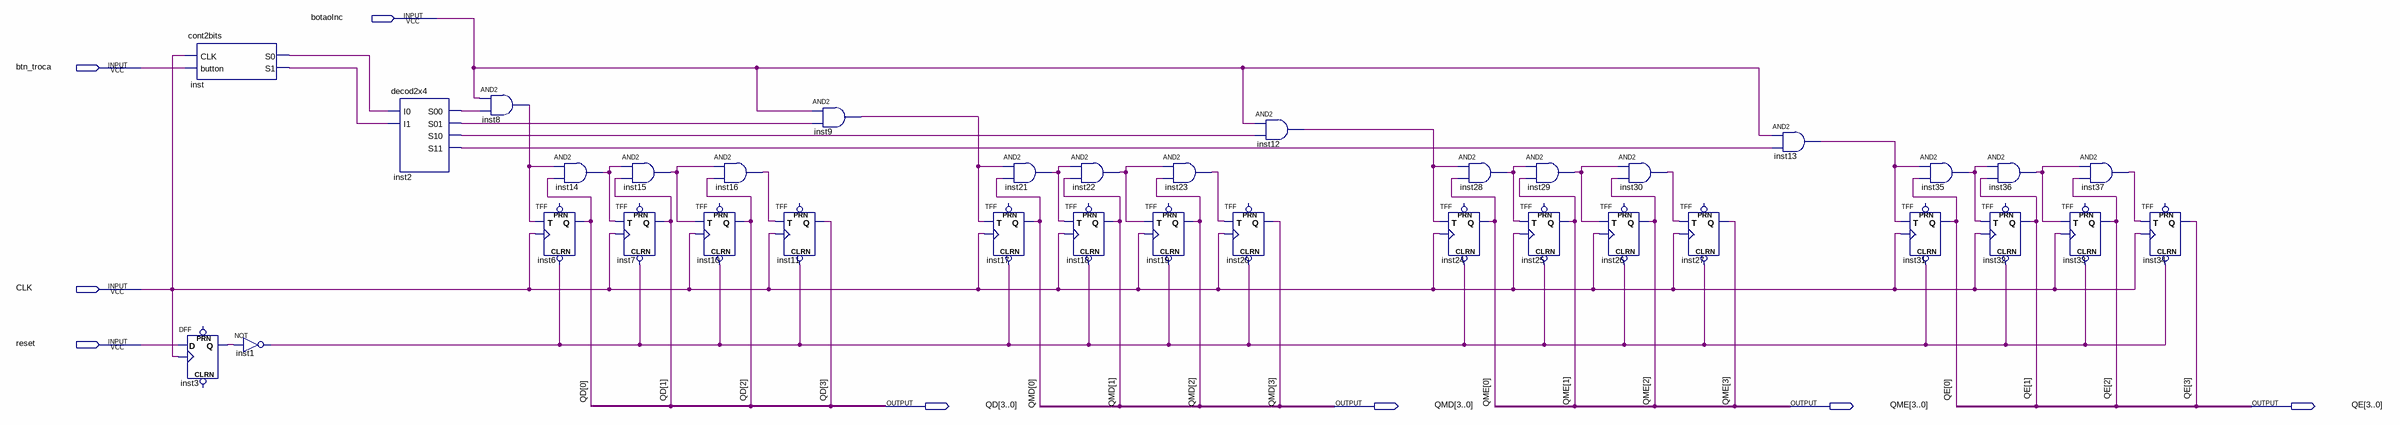
[diagram p0: schematic sheet]
// Quartus schematic regUser16bits.bdf as structural Verilog: 36 symbols, 8 pins
module regUser16bits (
  input  botaoInc,
  input  btn_troca,
  input  CLK,
  input  reset,
  output [3:0] QD,
  output [3:0] QMD,
  output [3:0] QME,
  output [3:0] QE
);

  wire inst1_out, inst2_s00, inst2_s01, inst2_s10, inst2_s11, inst3_q, inst8_out, inst9_out, inst12_out,
       inst13_out, inst14_out, inst15_out, inst16_out, inst21_out, inst22_out, inst23_out, inst28_out,
       inst29_out, inst30_out, inst35_out, inst36_out, inst37_out, inst_s0, inst_s1;

  cont2bits inst (.CLK(CLK), .button(btn_troca), .S0(inst_s0), .S1(inst_s1));
  DFF inst3 (.CLK(CLK), .D(reset), .Q(inst3_q));  // open: CLRN, PRN
  not inst1 (inst1_out, inst3_q);
  decod2x4 inst2 (.I0(inst_s0), .I1(inst_s1), .S00(inst2_s00), .S01(inst2_s01), .S10(inst2_s10), .S11(inst2_s11));
  and inst8 (inst8_out, botaoInc, inst2_s00);
  TFF inst6 (.CLRN(inst1_out), .T(inst8_out), .CLK(CLK), .Q(QD[0]));  // open: PRN
  and inst14 (inst14_out, inst8_out, QD[0]);
  and inst15 (inst15_out, inst14_out, QD[1]);
  TFF inst7 (.CLRN(inst1_out), .T(inst14_out), .CLK(CLK), .Q(QD[1]));  // open: PRN
  and inst16 (inst16_out, inst15_out, QD[2]);
  TFF inst10 (.CLRN(inst1_out), .T(inst15_out), .CLK(CLK), .Q(QD[2]));  // open: PRN
  TFF inst11 (.CLRN(inst1_out), .T(inst16_out), .CLK(CLK), .Q(QD[3]));  // open: PRN
  and inst9 (inst9_out, botaoInc, inst2_s01);
  and inst21 (inst21_out, inst9_out, QMD[0]);
  TFF inst17 (.CLRN(inst1_out), .T(inst9_out), .CLK(CLK), .Q(QMD[0]));  // open: PRN
  and inst22 (inst22_out, inst21_out, QMD[1]);
  TFF inst18 (.CLRN(inst1_out), .T(inst21_out), .CLK(CLK), .Q(QMD[1]));  // open: PRN
  and inst23 (inst23_out, inst22_out, QMD[2]);
  TFF inst19 (.CLRN(inst1_out), .T(inst22_out), .CLK(CLK), .Q(QMD[2]));  // open: PRN
  TFF inst20 (.CLRN(inst1_out), .T(inst23_out), .CLK(CLK), .Q(QMD[3]));  // open: PRN
  and inst12 (inst12_out, botaoInc, inst2_s10);
  and inst28 (inst28_out, inst12_out, QME[0]);
  TFF inst24 (.CLRN(inst1_out), .T(inst12_out), .CLK(CLK), .Q(QME[0]));  // open: PRN
  TFF inst25 (.CLRN(inst1_out), .T(inst28_out), .CLK(CLK), .Q(QME[1]));  // open: PRN
  and inst29 (inst29_out, inst28_out, QME[1]);
  and inst30 (inst30_out, inst29_out, QME[2]);
  TFF inst26 (.CLRN(inst1_out), .T(inst29_out), .CLK(CLK), .Q(QME[2]));  // open: PRN
  TFF inst27 (.CLRN(inst1_out), .T(inst30_out), .CLK(CLK), .Q(QME[3]));  // open: PRN
  and inst13 (inst13_out, botaoInc, inst2_s11);
  TFF inst31 (.CLRN(inst1_out), .T(inst13_out), .CLK(CLK), .Q(QE[0]));  // open: PRN
  and inst35 (inst35_out, inst13_out, QE[0]);
  and inst36 (inst36_out, inst35_out, QE[1]);
  TFF inst32 (.CLRN(inst1_out), .T(inst35_out), .CLK(CLK), .Q(QE[1]));  // open: PRN
  TFF inst33 (.CLRN(inst1_out), .T(inst36_out), .CLK(CLK), .Q(QE[2]));  // open: PRN
  and inst37 (inst37_out, inst36_out, QE[2]);
  TFF inst34 (.CLRN(inst1_out), .T(inst37_out), .CLK(CLK), .Q(QE[3]));  // open: PRN
endmodule
